# EAGLE design FEEDERLINK12 (EAGLE 9.6.1)
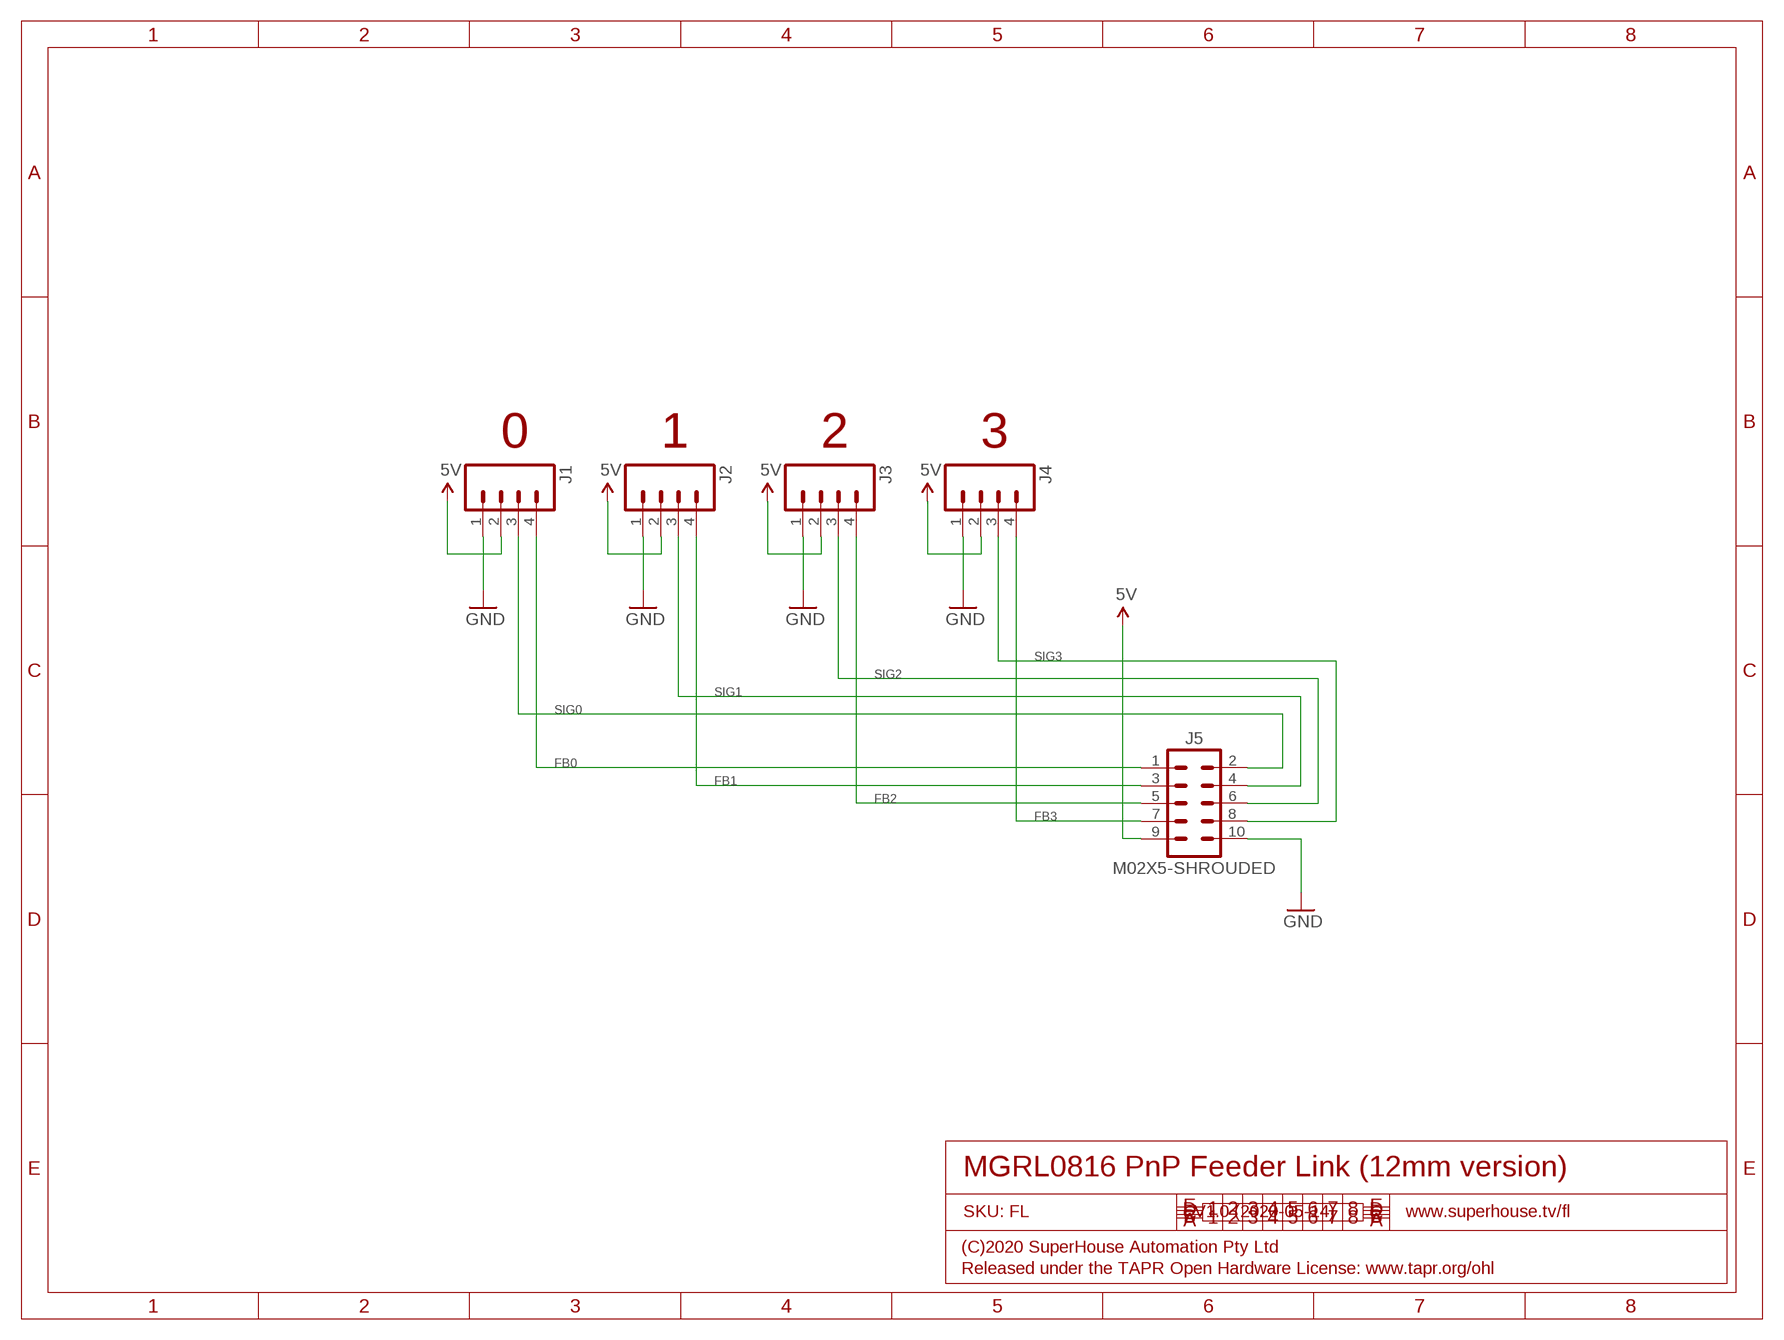
[diagram p0: schematic, sheet 1]

## Parts
J1  M04-SOCKET  [1X04-S]
J2  M04-SOCKET  [1X04-S]
J3  M04-SOCKET  [1X04-S]
J4  M04-SOCKET  [1X04-S]
J5  M02X5-SHROUDED  [2X05-2.54-SHROUDED]

## Nets
5V: J1.2 J2.2 J3.2 J4.2 J5.9
FB0: J1.4 J5.1
FB1: J2.4 J5.3
FB2: J3.4 J5.5
FB3: J4.4 J5.7
GND: J1.1 J2.1 J3.1 J4.1 J5.10
SIG0: J1.3 J5.2
SIG1: J2.3 J5.4
SIG2: J3.3 J5.6
SIG3: J4.3 J5.8

## Notes on the sheet
- 0 | 1 | 2 | 3
- MGRL0816 PnP Feeder Link (12mm version)
- SKU: FL | V1.0 (2020-05-14) | www.superhouse.tv/fl
- (C)2020 SuperHouse Automation Pty Ltd
- Released under the TAPR Open Hardware License: www.tapr.org/ohl

## Library data of the parts
J1-J4 = SuperHouse-Connectors:M04: 4-way header Standard 1x4 header, and screw terminal variations
J5 = SuperHouse-Connectors:M02X5: M10 header in 2x5 format

## Board
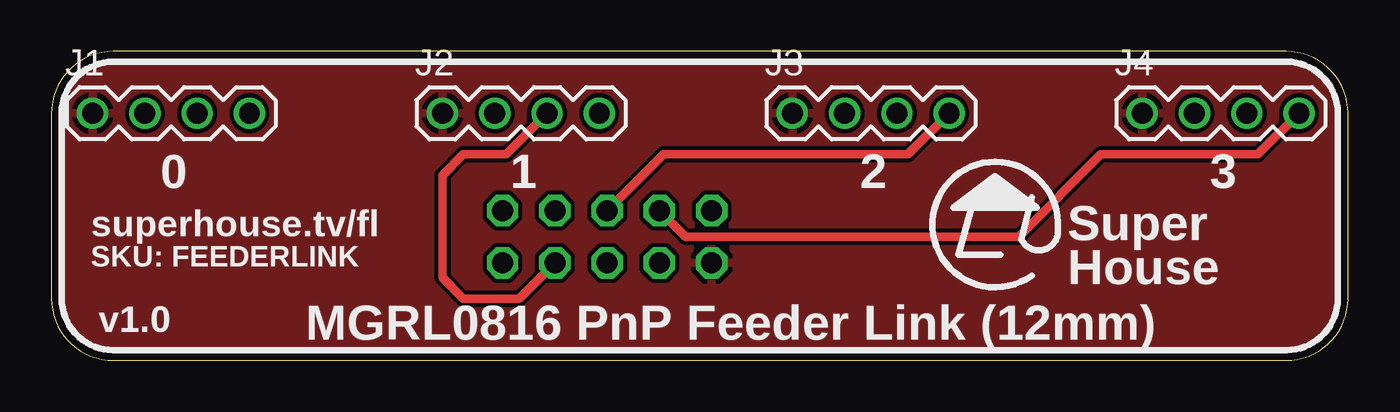
[diagram p1: board, top side]
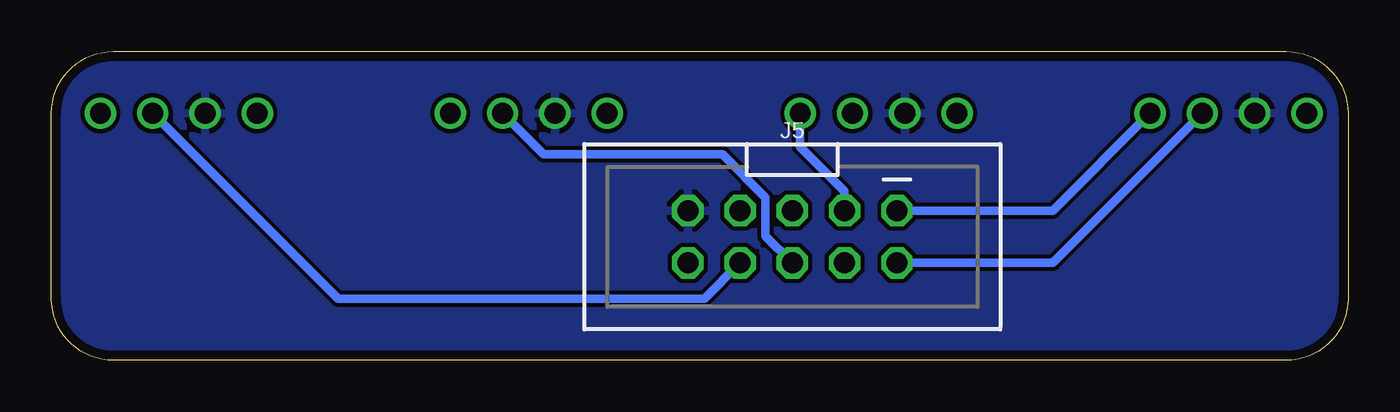
[diagram p2: board, bottom side, seen from below]

Size 63 x 15 mm. Coordinates in mm from the lower left corner, seen from the top.
Outline: 0,3 arc90 3,0 60,0 arc90 63,3 63,12 arc90 60,15 3,15 arc90 0,12 0,3
Copper layers (1*16): Top 0.035mm / dielectric 1.5mm / Bottom 0.035mm
Design rules "SuperHouse-Design-Rules": minimum track width 10mil, minimum drill 24mil, track to track 8mil, track to pad 8mil, pad to pad 8mil, via to via 8mil, smd to smd 6mil, copper to edge 18mil, drill to drill 8mil, minimum pad ring 10mil, minimum via ring 8mil, stop-mask expansion 4mil, vias tented up to drill 0.5mm, thermal gap 10mil

### Footprints (pad centres in the part's own frame; a part is rotated, then mirrored left to right if it is on the bottom)
1X04-S = drill 1.016: 1 0,0; 2 2.54,0; 3 5.08,0; 4 7.62,0
2X05-2.54-SHROUDED = drill 1.016 octagon: 1 -5.08,-1.27; 2 -5.08,1.27; 3 -2.54,-1.27; 4 -2.54,1.27; 5 0,-1.27; 6 0,1.27; 7 2.54,-1.27; 8 2.54,1.27; 9 5.08,-1.27; 10 5.08,1.27

### Placement (x,y rotation side)
J1  2,12 0 top
J2  19,12 0 top
J3  36,12 0 top
J4  53,12 0 top
J5  27,6 180 bottom

### Tracks (layer width: path | path; a pad name or v marks a point on that pad's centre or on a via)
5V
  pour Bottom: 0,12 arc-90 3,15 60,15 arc-90 63,12 63,3 arc-90 60,0 3,0 arc-90 0,3
FB0
  Bottom 0.406: J1.4 14.35,7.27 J5.1
FB1
  Bottom 0.406: J5.3 24.46,8.21 26.62,10.37 J2.4
FB2
  Top 0.406: J3.4 41.62,10 29.73,10 J5.5
FB3
  Top 0.406: J5.7 30.81,6 47,6 51,10 58.62,10 J4.4
GND
  pour Top: 0,12 arc-90 3,15 60,15 arc-90 63,12 63,3 arc-90 60,0 3,0 arc-90 0,3
SIG0
  Bottom 0.406: J1.3 14.35,4.73 J5.2
SIG1
  Top 0.406: J5.4 22.73,3 20,3 19,4 19,9 20,10 22.08,10 J2.3
SIG2
  Bottom 0.406: J3.3 39.08,10 30.4,10 28.3,7.9 28.3,6.03 J5.6
SIG3
  Bottom 0.406: J5.8 31.27,3 49.08,3 J4.3

### Text on the board
tPlace: 0 | 1 | 2 | 3 | superhouse.tv/fl | SKU: FEEDERLINK | Super / House | v1.0 | MGRL0816 PnP Feeder Link (12mm)